# Altium schematic sheet wardriver-sch.SchDoc
size B; Organization: Altium Limited; Address1: L3, 12a Rodborough Rd; Address2: Frenchs Forest; Address3: NSW; Address4: Australia 2086
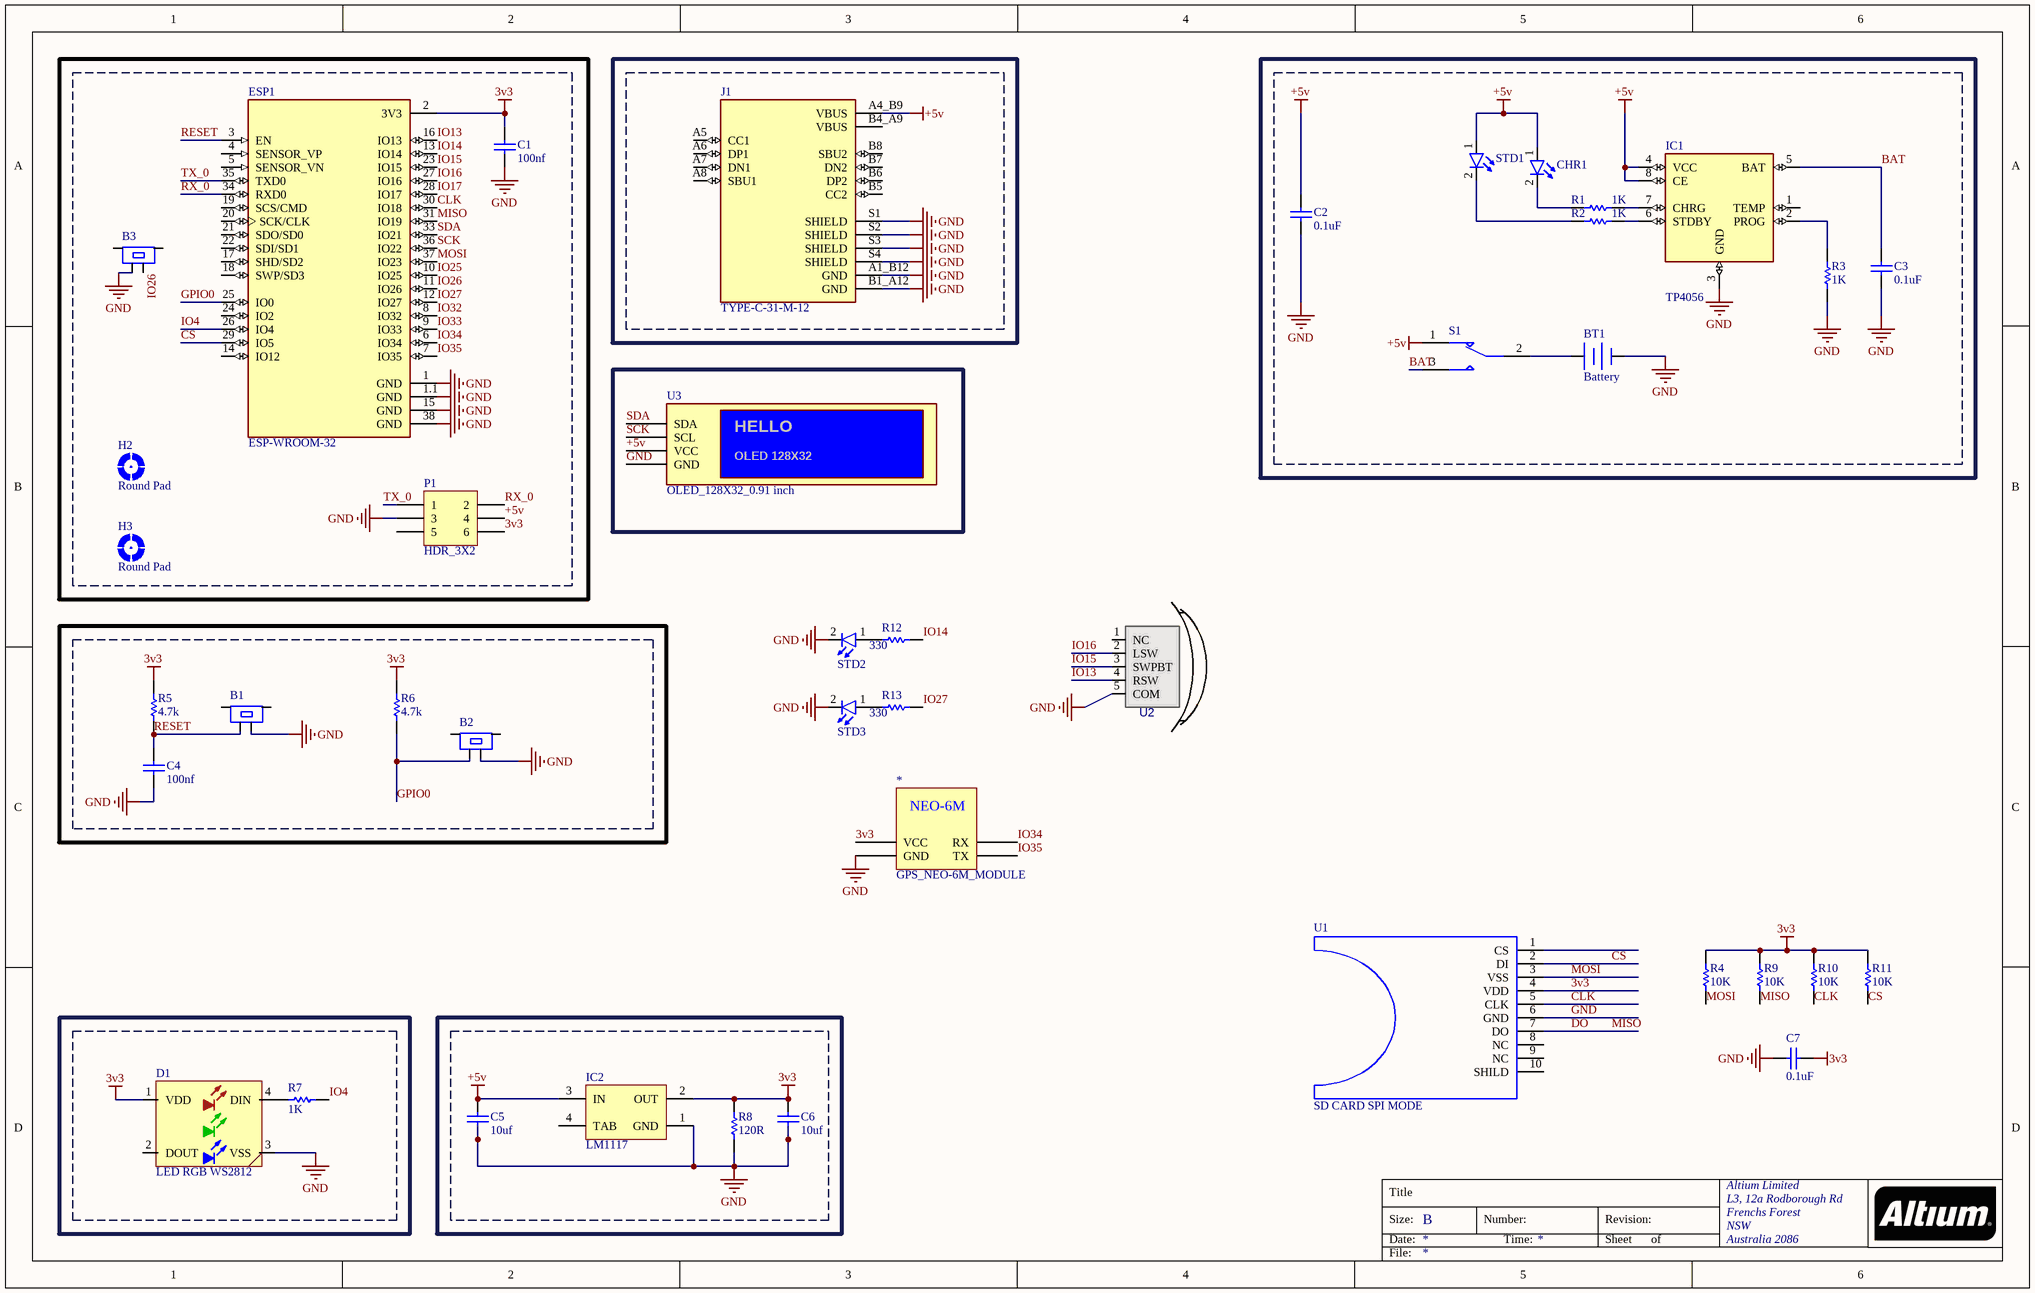
[diagram p0: wardriver-sch.SchDoc]

## Parts
*  GPS_NEO-6M_MODULE  [GPS_NEO-6M]
B1  BUTTON  [PUSH BUTTON SMD]  (value not drawn)
B2  BUTTON  [PUSH BUTTON SMD]  (value not drawn)
B3  BUTTON  [PUSH BUTTON SMD]  (value not drawn)
BT1  Battery  [Bat]
C1  100nf  [CAPC4817X12N]
C2  0.1uF  [CAPC4817X12N]
C3  0.1uF  [CAPC4817X12N]
C4  100nf  [CAPC4817X12N]
C5  10uf  [CAPC4817X12N]
C6  10uf  [CAPC4817X12N]
C7  0.1uF  [CAPC4817X12N]
CHR1  Red  [LED SMD 1206]  (value not drawn)
D1  LED RGB WS2812  [LED 5050 WS2812B]
ESP1  ESP-WROOM-32  [MODULE_ESP-WROOM-32]
H2  Round Pad  [P3.0C]  (no BOM)
H3  Round Pad  [P3.0C]  (no BOM)
IC1  TP4056  [SOP-8]
IC2  LM1117  [MP04A_M]
J1  TYPE-C-31-M-12  [HRO_TYPE-C-31-M-12]
P1  HDR_3X2  [MISC_HDR_2X3]
R1  1K  [RESC4817X04N]
R2  1K  [RESC4817X04N]
R3  1K  [RESC4817X04N]
R4  10K  [RES 0805]
R5  4.7k  [RESC4817X04N]
R6  4.7k  [RESC4817X04N]
R7  1K  [RESC4817X04N]
R8  120R  [RESC4817X04N]
R9  10K  [RES 0805]
R10  10K  [RES 0805]
R11  10K  [RES 0805]
R12  330  [RESC3413X04N]
R13  330  [RESC3413X04N]
S1  1437566-3  [Subminiator SPDT switch]  (value not drawn)
STD1  Red  [LED SMD 1206]  (value not drawn)
STD2  Red  [LED SMD 1206]  (value not drawn)
STD3  Red  [LED SMD 1206]  (value not drawn)
U1  SD CARD SPI MODE  [MICRO SD]
U2  CrescentSwitch  [SWCRE_SMD_13X13]  (value not drawn)
U3  OLED_128X32_0.91 inch  [OLED_128X32_0.91 inch]

## Nets
3v3: *.1(VCC) C1.2 C6.2 C7.1 D1.1(VDD) ESP1.2(3V3) IC2.2(OUT) P1.6 R4.2 R5.2 R6.2 R8.2 R9.2 R10.2 R11.2 U1.4(VDD)
+5v: C2.1 C5.2 CHR1.1(A) IC1.4(VCC) IC1.8(CE) IC2.3(IN) J1.A4_B9(VBUS) P1.4 S1.1 STD1.1(A) U3.2(VCC)
GND: *.4(GND) B1.2 B2.2 B3.3 BT1.2(-) C1.1 C2.2 C3.2 C4.1 C5.1 C6.1 C7.2 D1.3(VSS) ESP1.1(GND) ESP1.1.1(GND) ESP1.15(GND) ESP1.38(GND) IC1.3(GND) IC2.1(GND) J1.A1_B12(GND) J1.B1_A12(GND) J1.S1(SHIELD) J1.S2(SHIELD) J1.S3(SHIELD) J1.S4(SHIELD) P1.3 R3.2 R8.1 STD2.2(K) STD3.2(K) U1.6(GND) U2.5(COM) U3.1(GND)
SHIELD: H2.P H3.P
BAT: C3.1 IC1.5(BAT) S1.3
CLK: ESP1.30(IO18) R10.1 U1.5(CLK)
CS: ESP1.29(IO5) R11.1 U1.2(DI)
DO: ESP1.31(IO19) R9.1 U1.7(DO)  [also labelled MISO]
GPIO0: B2.3 ESP1.25(IO0) R6.1
IO4: ESP1.26(IO4) R7.1
IO13: ESP1.16(IO13) U2.4(RSW)
IO14: ESP1.13(IO14) R12.1
IO15: ESP1.23(IO15) U2.3(SWPBT)
IO16: ESP1.27(IO16) U2.2(LSW)
IO17: ESP1.28(IO17)
IO25: ESP1.10(IO25)
IO26: B3.2 ESP1.11(IO26)
IO27: ESP1.12(IO27) R13.1
IO32: ESP1.8(IO32)
IO33: ESP1.9(IO33)
IO34: *.2(RX) ESP1.6(IO34)
IO35: *.3(TX) ESP1.7(IO35)
MOSI: ESP1.37(IO23) R4.1 U1.3(VSS)
RESET: B1.3 C4.2 ESP1.3(EN) R5.1
RX_0: ESP1.34(RXD0) P1.2
SCK: ESP1.36(IO22) U3.3(SCL)
SDA: ESP1.33(IO21) U3.4(SDA)
TX_0: ESP1.35(TXD0) P1.1
NetBT1_1: BT1.1(+) S1.2
NetCHR1_2: CHR1.2(K) R1.1
NetD1_4: D1.4(DIN) R7.2
NetIC1_2: IC1.2(PROG) R3.1
NetIC1_6: IC1.6(STDBY) R2.2
NetIC1_7: IC1.7(CHRG) R1.2
NetR2_1: R2.1 STD1.2(K)
NetR12_2: R12.2 STD2.1(A)
NetR13_2: R13.2 STD3.1(A)

Not connected (* = marked no-connect by the designer): B1 1 4; B2 1 4; B3 1 4; D1 2(DOUT); ESP1 4(SENSOR_VP) 5(SENSOR_VN) 14(IO12) 17(SHD/SD2) 18(SWP/SD3) 19(SCS/CMD) 20(SCK/CLK) 21(SDO/SD0) 22(SDI/SD1) 24(IO2); IC1 1(TEMP); IC2 4(TAB); J1 A5(CC1) A6(DP1) A7(DN1) A8(SBU1) B4_A9(VBUS) B5(CC2) B6(DP2) B7(DN2) B8(SBU2); P1 5; U1 1(CS) 8(NC) 9(NC) 10(SHILD); U2 1(NC)

## Notes on the sheet
- Title
- Size:
- Date:
- B
- Number:
- Time:
- Revision:
- Sheet
- of
- File:
- (in symbol GPS_NEO-6M_MODULE) NEO-6M
- (in symbol OLED_128X32_0.91 inch) HELLO; OLED 128X32

## Library data of the parts
B1-B3 = PUSH BUTTON RIGHT: PUSH BUTTON
C1-C7 = CAP SMD 1206: CAP 1206; Designer: Abbas Basereh; Desc.: CAP SMD 1206; Data: 16-12-2016
CHR1 STD1-STD3 = LED: Designer: Saeid Jorablo; Organazation: ControTec; Adding Date: 1387/12/22; Color: Red; Size: SMD 1206
D1 = LED RGB WS2812: LED
ESP1 = ESP-WROOM-32: WiFi 802.11b/g/n/d/e/i Transceiver Module 2.4GHz Surface Mount; MF: Olimex LTD; Value: *; SnapEDA_Link: https://www.snapeda.com/parts/ESP-WROOM-32/Olimex%20LTD/view-part/2311927/?ref=snap; MP: ESP-WROOM-32; Availability: Unavailable; Price: None; Package: Module Olimex LTD
H2 H3 = MOUNT-PAD-ROUND: MOUNTING PAD, round
IC1 = TP4056: Complete single cell Li-Ion battery with a constant current / constant voltage linear charger; MF: NanJing Top Power ASIC Corp.; Package: Package Analog Devices; MP: TP4056; Value: *; SnapEDA_Link: https://www.snapeda.com/parts/TP4056%20/NanJing%20Top%20Power%20ASIC%20Corp./view-part/2888426/?ref=snap; Price: None; Availability: Unavailable
IC2 = LM1117IMP-x.x: x.x Volt, 800mA Low-Dropout Linear Regulator, 4-pin SOT-223; PartNumber: LM1117IMP-3.3; Manufacturer: National Semiconductor; PackageTopMarking: XYTT*N05B; PowerWise: N; CompType: LDO IC; Published: 4-Dec-2008; DatasheetVersion: Apr-2006; PackageVersion: revB, Apr-2003; PackageReference: MP04A; Publisher: Altium Limited; PackageDescription: Molded SOT-223, 6.50 x 3.56 x 1.6mm Body, 4 Lead, 2.3mm Pitch; Supplier 1: Farnell; Supplier Part Number 1: 7614123; RoHS: N; PinCount: 4; Code_JEDEC: TO-261-AA; Code_IPC: SOT223-4; ComponentLink1Description: LM1117 Datasheet; ComponentLink1URL: http://www.national.com/ds/LM/LM1117.pdf; ComponentLink2Description: LM1117 Web Page; ComponentLink2URL: http://www.national.com/pf/LM/LM1117.html; ComponentLink3Description: MP04A Package Page; ComponentLink3URL: http://www.national.com/packaging/folders/mp04a.html
J1 = TYPE-C-31-M-12: USB Connectors 24 Receptacle 1 8.94*7.3mm RoHS; MF: HRO Electronics Co., Ltd.; Price: None; Value: *; SnapEDA_Link: https://www.snapeda.com/parts/TYPE-C-31-M-12/HRO+Electronics+Co.%252C+Ltd./view-part/?ref=snap; Package: Package; Availability: Not in stock; Check_prices: https://www.snapeda.com/parts/TYPE-C-31-M-12/HRO+Electronics+Co.%252C+Ltd./view-part/?ref=eda; MP: TYPE-C-31-M-12
P1 = HDR_3X2: Header, 3-Pin, Dual row; designer: Eng. Saeid Jorablo; Company: SJ Libraries; Max Current: mA; LatestRevisionDate: 17-Jul-2002; Publisher: SJ UnLimited; Mounting Technology: Through-Hole; Category: Headers; Pin Count: 6; Status: Unreleased; ComponentLink1Description: Datasheet; ComponentLink2Description: Reference; Update: 7/8/2012; HelpURL: http://s3.picofile.com/file/7443264187/Coming_Soon_logo.gif
R1-R3 R5-R8 = RES 1206 0.25W: RES 1206; Designer: Abbas Basereh; Desc.: RES SMD 1206; Data: 16-12-2016
R4 R9-R11 = RES: RESISTOR
R12 R13 = RES 0805 0.125W: RES 0805; Designer: Abbas Basereh; Desc.: RES SMD 0805; Data: 16-12-2016
S1 = Subminiator SPDT switch
U2 = SWCRE_SMD_13X13: SWITCH, CRESCENT, 13X13mm, SMD; DESIGN BY: A-SHAMSAEI; VALUE: CrescentSwitch; PARAM: PARAM; PARAM2: PARAM2
U3 = OLED_128X32_0.91 inch: OLED_128X64_0.96 inch; ASSEMBLY: *; DESC: *; DIST#: *; MANF: *; MANF_P#: *; PARAM2: *; PARAM: *; PRICE: *; VALUE: *